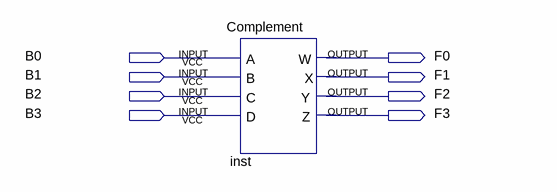
[diagram p0: schematic sheet]
// Quartus schematic Block_9complement.bdf as structural Verilog: 1 symbols, 8 pins
module Block_9complement (
  input  B0,
  input  B1,
  input  B2,
  input  B3,
  output F0,
  output F1,
  output F2,
  output F3
);

  Complement inst (.A(B0), .B(B1), .C(B2), .D(B3));  // open: W, X, Y, Z
endmodule
